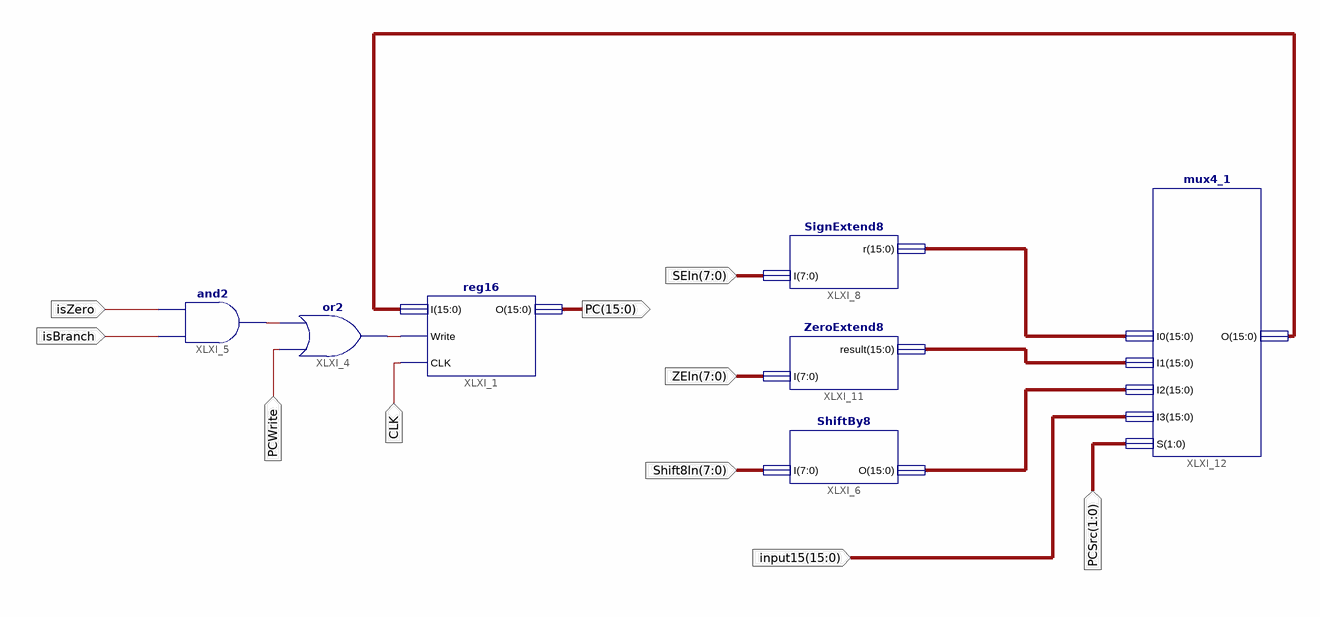
[diagram p0: schematic sheet 1]
// Xilinx ISE schematic Int6_PCSrc.sch (spartan3adsp) as structural Verilog: 7 symbols, 10 ports
module Int6_PCSrc (
  input  PCWrite,
  input  isBranch,
  input  isZero,
  input  CLK,
  input  [1:0] PCSrc,
  input  [7:0] Shift8In,
  input  [7:0] ZEIn,
  input  [7:0] SEIn,
  input  [15:0] input15,
  output [15:0] PC
);

  wire XLXN_4, XLXN_5;
  wire [15:0] XLXN_1, XLXN_25, XLXN_26, XLXN_27;

  and XLXI_5 (XLXN_5, isBranch, isZero);
  or XLXI_4 (XLXN_4, PCWrite, XLXN_5);
  reg16 XLXI_1 (.I(XLXN_1), .Write(XLXN_4), .CLK(CLK), .O(PC));
  mux4_1 XLXI_12 (.I0(XLXN_25), .I1(XLXN_26), .I2(XLXN_27), .I3(input15), .S(PCSrc), .O(XLXN_1));
  ShiftBy8 XLXI_6 (.I(Shift8In), .O(XLXN_27));
  ZeroExtend8 XLXI_11 (.result(XLXN_26), .I(ZEIn));
  SignExtend8 XLXI_8 (.r(XLXN_25), .I(SEIn));
endmodule
